# EAGLE design Baseboard_Main (EAGLE 9.5.2)
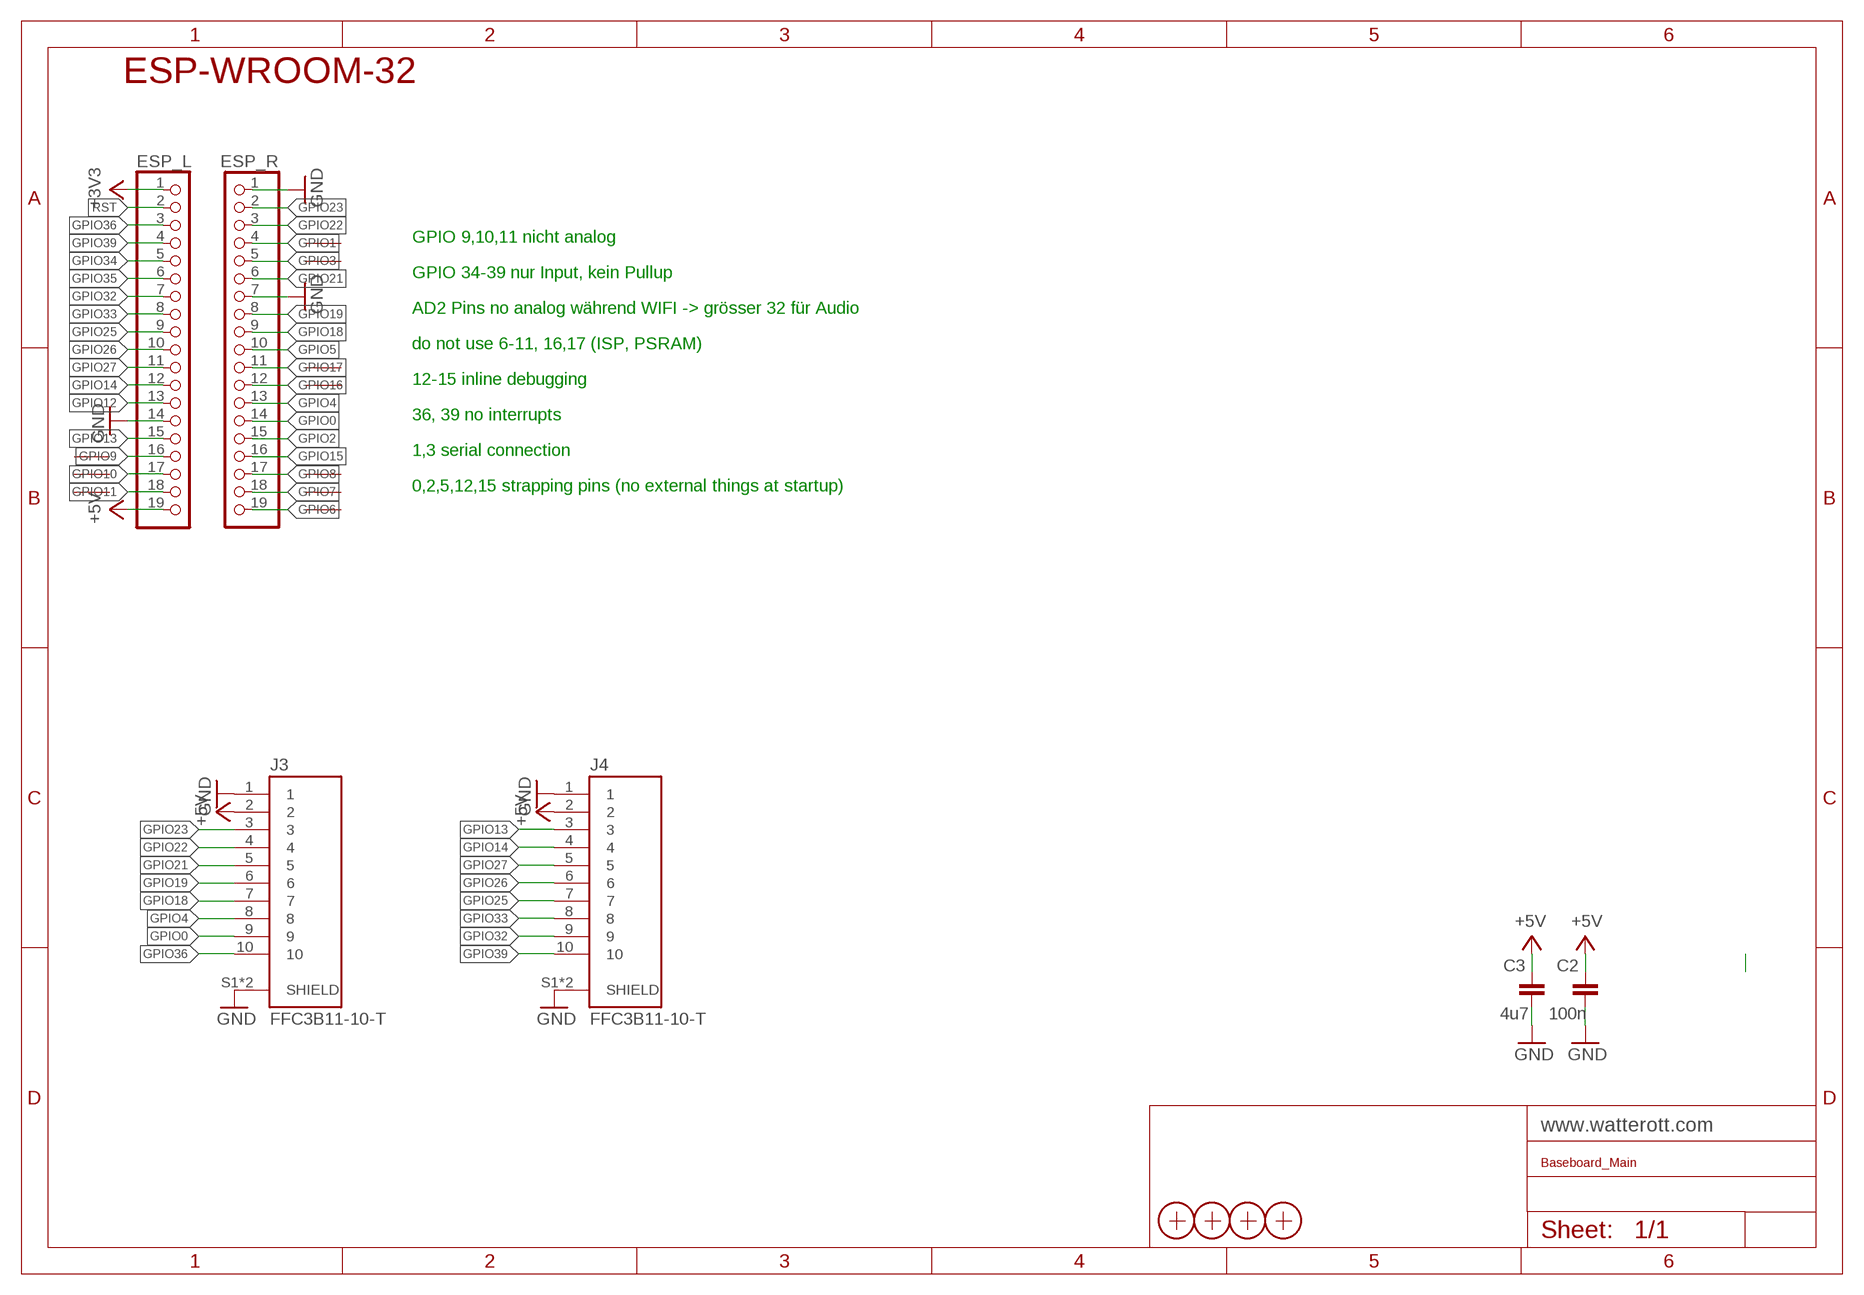
[diagram p0: schematic, sheet 1]

## Parts
C2  100n  CAPACITOR-0805  [C0805]
C3  4u7  CAPACITOR-0805  [C0805]
ESP_L  PINHD-1X19  [1X19]
ESP_R  PINHD-1X19  [1X19]
J3  FFC3B11-10-T  [GCT_FFC3B11-10-T]
J4  FFC3B11-10-T  [GCT_FFC3B11-10-T]
X1  PASSER-07  [PASSER_07MM]
X2  PASSER-07  [PASSER_07MM]
X3  PASSER-07  [PASSER_07MM]
X4  PASSER-07  [PASSER_07MM]

## Nets
+3V3: ESP_L.1
+5V: C2.2 C3.2 ESP_L.19 J3.2 J4.2
GND: C2.1 C3.1 ESP_L.14 ESP_R.1 ESP_R.7 J3.1 J3.S1(SHIELD) J3.S2(SHIELD) J4.1 J4.S1(SHIELD) J4.S2(SHIELD)
GPIO0: ESP_R.14 J3.9
GPIO1: ESP_R.4
GPIO2: ESP_R.15
GPIO3: ESP_R.5
GPIO4: ESP_R.13 J3.8
GPIO5: ESP_R.10
GPIO6: ESP_R.19
GPIO7: ESP_R.18
GPIO8: ESP_R.17
GPIO9: ESP_L.16
GPIO10: ESP_L.17
GPIO11: ESP_L.18
GPIO12: ESP_L.13
GPIO13: ESP_L.15 J4.3
GPIO14: ESP_L.12 J4.4
GPIO15: ESP_R.16
GPIO16: ESP_R.12
GPIO17: ESP_R.11
GPIO18: ESP_R.9 J3.7
GPIO19: ESP_R.8 J3.6
GPIO21: ESP_R.6 J3.5
GPIO22: ESP_R.3 J3.4
GPIO23: ESP_R.2 J3.3
GPIO25: ESP_L.9 J4.7
GPIO26: ESP_L.10 J4.6
GPIO27: ESP_L.11 J4.5
GPIO32: ESP_L.7 J4.9
GPIO33: ESP_L.8 J4.8
GPIO34: ESP_L.5
GPIO35: ESP_L.6
GPIO36: ESP_L.3 J3.10
GPIO39: ESP_L.4 J4.10
RST: ESP_L.2

## Notes on the sheet
- ESP-WROOM-32
- GPIO 9,10,11 nicht analog
- GPIO 34-39 nur Input, kein Pullup
- AD2 Pins no analog während WIFI -> grösser 32 für Audio
- do not use 6-11, 16,17 (ISP, PSRAM)
- 12-15 inline debugging
- 36, 39 no interrupts
- 1,3 serial connection
- 0,2,5,12,15 strapping pins (no external things at startup)

## Library data of the parts
C2 C3 = we-rcl:CAPACITOR: Capacitor ...2.2uF @ 6.3V -> 0402 ...4.7uF @ 6.3V -> 0603 ...10uF @ 16V -> 0805 ...22uF @ 25V -> 1206
ESP_L ESP_R = pinhead:PINHD-1X19: PIN HEADER
J3 J4 = FFC3B11-10-T:FFC3B11-10-T: FPC 1.0mm Pitch, Side entry, Top contact, SMT, Height 2.5mm, Slide type Check availability <https://pricing.snapeda.com/parts/FFC3B11-10-T/Global%20Connector%20Technology/view-part?ref=eda>; AVAILABILITY: In Stock; DESCRIPTION: 10 Position FFC, FPC Connector Contacts, Top 0.039 (1.00mm) Surface Mount, Right Angle; MF: Global Connector Technology; MP: FFC3B11-10-T; PACKAGE: None; PRICE: None; PURCHASE-URL: https://pricing.snapeda.com/search/part/FFC3B11-10-T/?ref=eda
X1-X4 = we-symbol:PASSER: Fiducial Marker

## Board
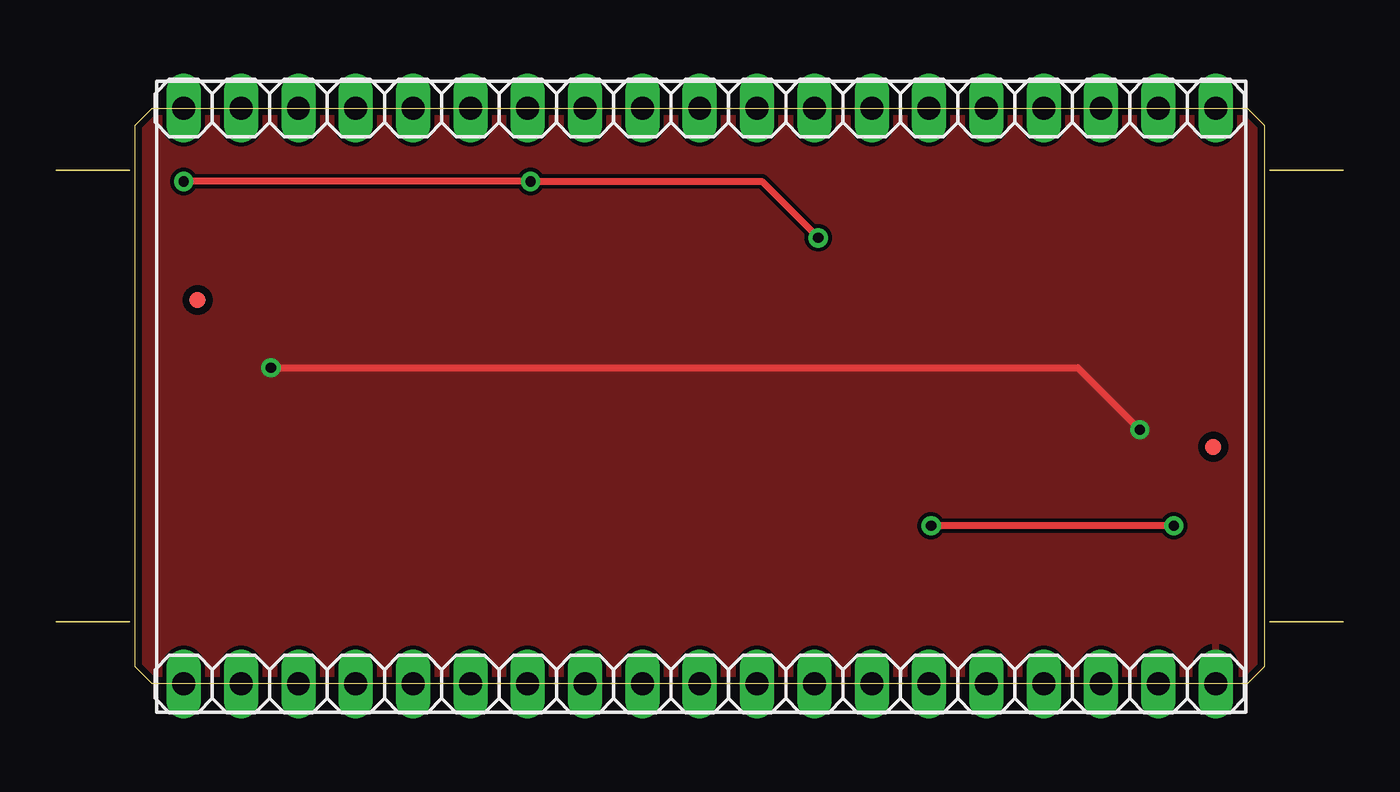
[diagram p1: board, top side]
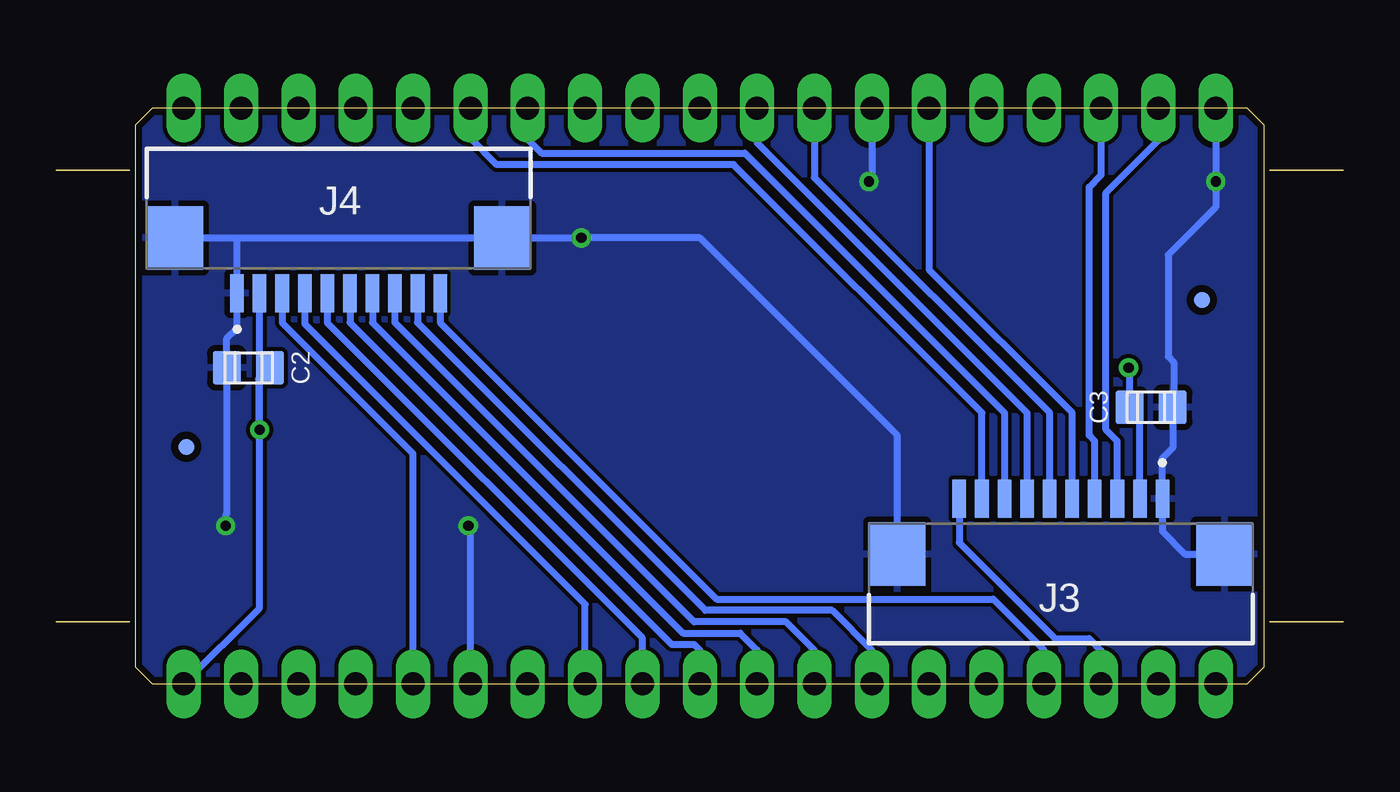
[diagram p2: board, bottom side, seen from below]

Size 57 x 25.5 mm. Coordinates in mm from the lower left corner, seen from the top.
Outline: 3.25,22.75 0,22.75
Outline: 3.25,2.75 0,2.75
Outline: 57,22.75 53.75,22.75
Outline: 57,2.75 53.75,2.75
Outline: 53.5,0.75 52.75,0 4.25,0 3.5,0.75 3.5,24.75 4.25,25.5 52.75,25.5 53.5,24.75 53.5,0.75
Copper layers (1*16): Top 0.035mm / dielectric 1.5mm / Bottom 0.035mm
Design rules "aisler_2_layer_simple": minimum track width 0.2mm, minimum drill 0.45mm, track to track 0.175mm, track to pad 0.175mm, pad to pad 0.175mm, via to via 0.175mm, smd to smd 0.175mm, copper to edge 0.3mm, drill to drill 0.25mm, minimum pad ring 0.2mm, minimum via ring 0.2mm, stop-mask expansion 0mil, vias tented up to drill 0mil, thermal gap 10mil

### Footprints (pad centres in the part's own frame; a part is rotated, then mirrored left to right if it is on the bottom)
C0805 = smd 1.5 x 1.25: 1 0,0.95; 2 0,-0.95
1X19 = drill 1.016 long: 1 -22.86,0; 2 -20.32,0; 3 -17.78,0; 4 -15.24,0; 5 -12.7,0; 6 -10.16,0; 7 -7.62,0; 8 -5.08,0; 9 -2.54,0; 10 0,0; 11 2.54,0; 12 5.08,0; 13 7.62,0; 14 10.16,0; 15 12.7,0; 16 15.24,0; 17 17.78,0; 18 20.32,0; 19 22.86,0
GCT_FFC3B11-10-T = smd 0.6 x 1.7: 1 4.5,2.45; 2 3.5,2.45; 3 2.5,2.45; 4 1.5,2.45; 5 0.5,2.45; 6 -0.5,2.45; 7 -1.5,2.45; 8 -2.5,2.45; 9 -3.5,2.45; 10 -4.5,2.45 | smd 2.5 x 2.8: S1 7.25,0; S2 -7.25,0
PASSER_07MM = smd 0.7 x 0.7: X 0,0

### Placement (x,y rotation side)
C2  48.5,14 90 bottom
C3  8.5,12.25 270 bottom
ESP_L  28.5,0 0 top
ESP_R  28.5,25.5 0 top
J3  12.5,5.75 0 bottom
J4  44.5,19.75 180 bottom
X1  6.25,17 180 bottom
X2  51.25,10.5 180 bottom
X3  6.25,17 0 top
X4  51.25,10.5 0 top

### Tracks (layer width: path | path; a pad name or v marks a point on that pad's centre or on a via)
+5V  (via drill 0.45)
  Top 0.3: v9.5,14 45.25,14 v48,11.25
  Bottom 0.3: ESP_L.19 48,3.36 48,13.55 | 48,13.55 48,13.75 | 48,13.75 J4.2 | C2.2 47.75,14 48,13.75 | J3.2 9,11.8 C3.2 9.45,13.95 v9.5,14 | C2.2 48,13.55 | v48,11.25 48.05,11.3 48.05,13.5 C2.2
  pour Top: 3.75,25.25 3.75,0.25 53.25,0.25 53.25,25.25
GND  (via drill 0.45)
  Top 0.3: v49.5,7 v38.75,7 | v33.75,19.75 31.25,22.25 v21,22.25 v5.64,22.25
  Bottom 0.3: J4.S1 52,19.75 52.25,19.5 52,19.5 J4.S1 | v49.5,7 49.5,7.5 49.45,7.55 C2.1 49.45,15.3 49,15.75 J4.1 49,19.75 | ESP_L.14 38.66,6.91 v38.75,7 | J4.S1 49,19.75 | 49,19.75 J4.S2 v33.75,19.75 28.5,19.75 19.75,11 J3.S2 | C3.1 7.55,12 | 7.55,12 7.55,10.45 8,10 J3.1 8,6.75 7,5.75 J3.S1 | ESP_R.1 v5.64,22.25 5.64,21.11 7.75,19 7.75,14.5 7.5,14.25 7.5,12.05 7.55,12 | ESP_R.7 20.88,22.37 v21,22.25
  pour Bottom: 3.75,25.5 3.75,0.25 53.25,0.25 53.25,25.5
GPIO0
  Bottom 0.3: ESP_R.14 38.66,24.16 37.5,23 27,23 16,12 J3.9
GPIO4
  Bottom 0.3: ESP_R.13 36.12,24.12 35.5,23.5 26.5,23.5 15,12 J3.8
GPIO13
  Bottom 0.3: J4.3 47,16 41.2,10.2 ESP_L.15
GPIO14
  Bottom 0.3: ESP_L.12 33.58,3.52 46,15.94 J4.4
GPIO18
  Bottom 0.3: J3.7 14,12 25.96,23.96 ESP_R.9
GPIO19
  Bottom 0.3: J3.6 13,12 23.42,22.42 ESP_R.8
GPIO21
  Bottom 0.3: J3.5 12,12 18.34,18.34 ESP_R.6
GPIO22
  Bottom 0.3: ESP_R.3 10.72,22.53 11.25,22 11.25,11 11,10.75 J3.4
GPIO23
  Bottom 0.3: J3.3 10,10.75 10.5,11.25 10.5,21.75 8.18,24.07 ESP_R.2
GPIO25
  Bottom 0.3: J4.7 43,16 29.25,2.25 26.71,2.25 25.96,1.5 ESP_L.9
GPIO26
  Bottom 0.3: J4.6 44,16 29.75,1.75 28.75,1.75 28.5,1.5 ESP_L.10
GPIO27
  Bottom 0.3: J4.5 45,16 31.04,2.04 ESP_L.11
GPIO32
  Bottom 0.3: J4.9 41,16 28.25,3.25 22.63,3.25 20.88,1.5 ESP_L.7
GPIO33
  Bottom 0.3: J4.8 42,16 28.75,2.75 24.67,2.75 23.42,1.5 ESP_L.8
GPIO36
  Bottom 0.3: ESP_L.3 10.72,1.47 11.25,2 12.75,2 17,6.25 J3.10
GPIO39
  Bottom 0.3: J4.10 40,16 27.75,3.75 15.5,3.75 13.26,1.51 ESP_L.4